# EAGLE design LED_Matrix_3_5_tiny (EAGLE 8.2.2)
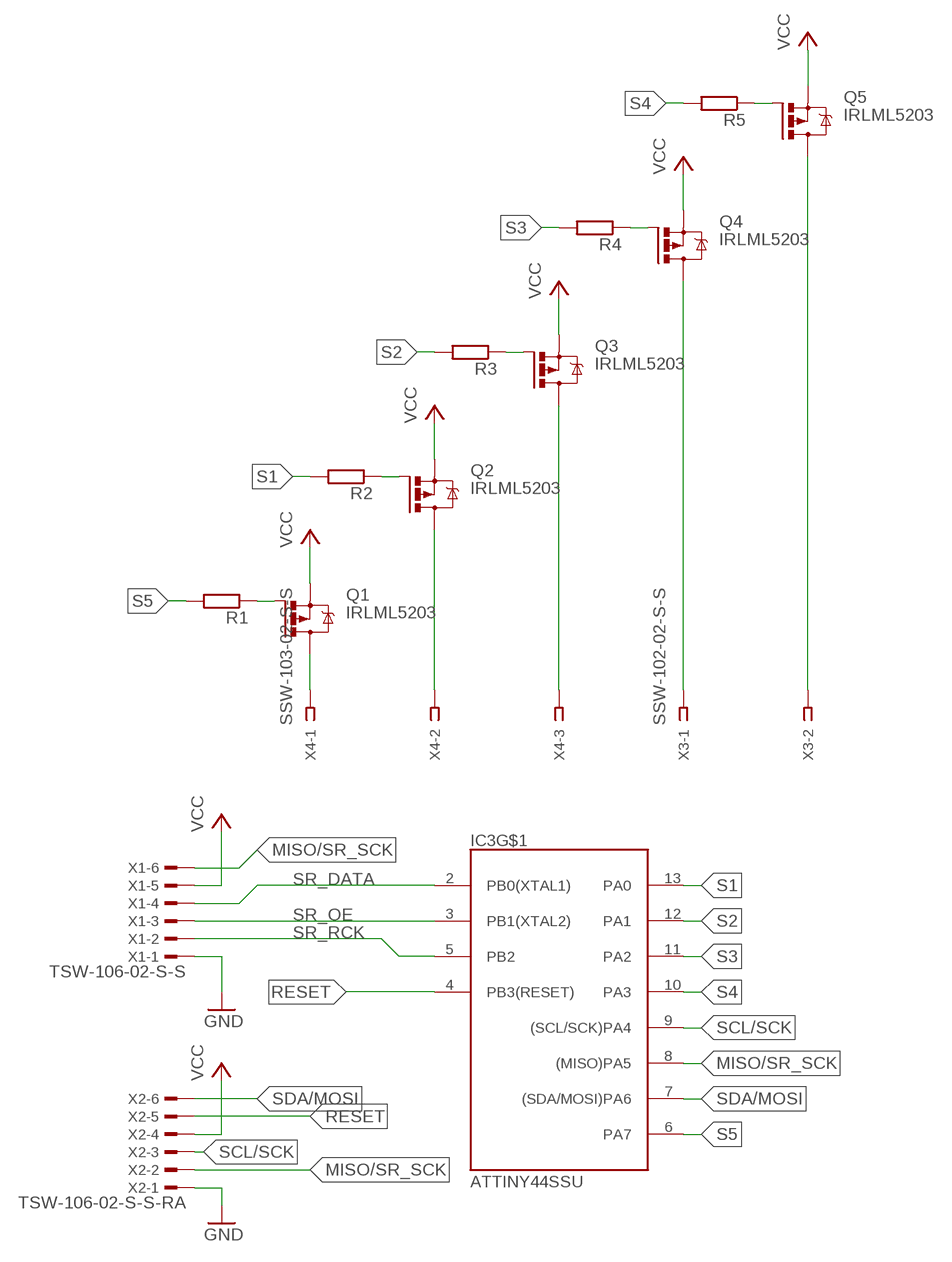
[diagram p0: schematic, sheet 1]

## Parts
IC3  ATTINY44SSU  [SO14]
Q1  IRLML5203  [MICRO3]
Q2  IRLML5203  [MICRO3]
Q3  IRLML5203  [MICRO3]
Q4  IRLML5203  [MICRO3]
Q5  IRLML5203  [MICRO3]
R1  R-EU_R0603  [R0603]
R2  R-EU_R0603  [R0603]
R3  R-EU_R0603  [R0603]
R4  R-EU_R0603  [R0603]
R5  R-EU_R0603  [R0603]
X1  TSW-106-02-S-S  [TSW-106-02-S-S]
X2  TSW-106-02-S-S-RA  [TSW-106-02-S-S-RA]
X3  SSW-102-02-S-S  [SSW-102-02-S-S]
X4  SSW-103-02-S-S  [SSW-103-02-S-S]

## Nets
GND: X1.1 X2.1
MISO/SR_SCK: IC3.8((MISO)PA5) X1.6 X2.2
N$9: Q2.1(G) R2.1
N$15: Q3.1(G) R3.1
N$16: Q4.1(G) R4.1
N$17: Q5.1(G) R5.1
N$18: Q1.1(G) R1.1
N$19: Q5.3(D) X3.2
N$20: Q4.3(D) X3.1
N$21: Q3.3(D) X4.3
N$22: Q2.3(D) X4.2
N$23: Q1.3(D) X4.1
RESET: IC3.4(PB3(RESET)) X2.5
S1: IC3.13(PA0) R2.2
S2: IC3.12(PA1) R3.2
S3: IC3.11(PA2) R4.2
S4: IC3.10(PA3) R5.2
S5: IC3.6(PA7) R1.2
SCL/SCK: IC3.9((SCL/SCK)PA4) X2.3
SDA/MOSI: IC3.7((SDA/MOSI)PA6) X2.6
SR_DATA: IC3.2(PB0(XTAL1)) X1.4
SR_OE: IC3.3(PB1(XTAL2)) X1.3
SR_RCK: IC3.5(PB2) X1.2
VCC: Q1.2(S) Q2.2(S) Q3.2(S) Q4.2(S) Q5.2(S) X1.5 X2.4

## Power pins joined to a net without a drawn wire
GND: IC3.14(GND)
VCC: IC3.1(VCC)

## Library data of the parts
IC3 = Attiny:ATTINY44: ATtiny24A/44A/84A are low-power CMOS 8-bit microcontrollers based on the AVR enhanced RISC architecture. By executing powerful in structions in a single clock cycle, the ATtiny24A/44A/84A achieves throughputs approaching 1 MIPS per MHz allowing the system designer to optimize power consum ption versus processing speed.
Q1-Q5 = transistor-power:IRLML5203: HEXFET P-Channel Power MOSFET
R1-R5 = resistor:R-EU_: RESISTOR, European symbol
X1 X2 = con-samtec:TSW-106-02-S-S: THROUGH-HOLE .025" SQ POST HEADER Source: Samtec TSW.pdf; OC_FARNELL: unknown; OC_NEWARK: unknown
X3 = con-samtec:SSW-102-02-S-S: THROUGH-HOLE .025" SQ POST SOCKET Source: Samtec SSW.pdf; MPN: SSW-102-02-S-S; OC_FARNELL: unknown; OC_NEWARK: 11P9351
X4 = con-samtec:SSW-103-02-S-S: THROUGH-HOLE .025" SQ POST SOCKET Source: Samtec SSW.pdf; MPN: SSW-103-02-S-S; OC_FARNELL: unknown; OC_NEWARK: 11P9367

## Board
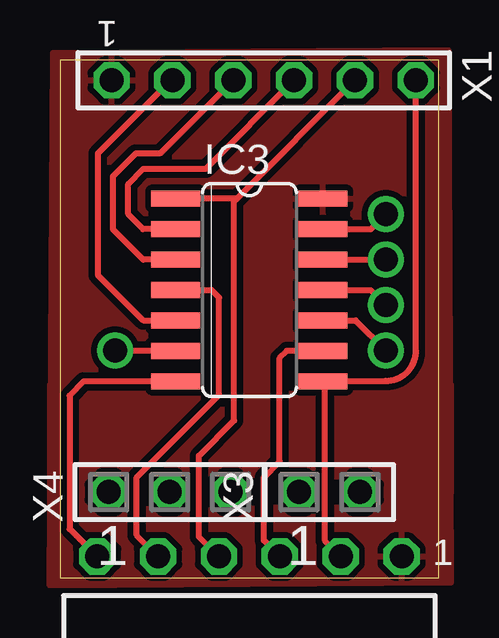
[diagram p1: board, top side]
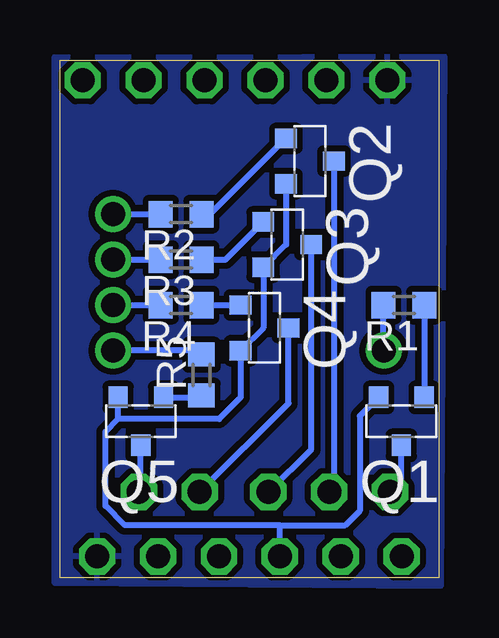
[diagram p2: board, bottom side, seen from below]

Size 15.8 x 21.6 mm. Coordinates in mm from the lower left corner, seen from the top.
Outline: 0,0 15.8,0 15.8,21.6 0,21.6 0,0
Copper layers (1*16): Top 0.035mm / dielectric 1.5mm / Bottom 0.035mm
Design rules "default *": minimum track width 10mil, minimum drill 24mil, track to track 10mil, track to pad 10mil, pad to pad 10mil, via to via 10mil, smd to smd 8mil, copper to edge 0mil, drill to drill 8mil, minimum pad ring 10mil, minimum via ring 8mil, stop-mask expansion 4mil, vias tented up to drill 0mil, thermal gap 10mil

### Footprints (pad centres in the part's own frame; a part is rotated, then mirrored left to right if it is on the bottom)
SO14 = smd 0.66 x 2.032: 1 -3.81,-3.073; 2 -2.54,-3.073; 3 -1.27,-3.073; 4 0,-3.073; 5 1.27,-3.073; 6 2.54,-3.073; 7 3.81,-3.073; 8 3.81,3.073; 9 2.54,3.073; 10 1.27,3.073; 11 0,3.073; 12 -1.27,3.073; 13 -2.54,3.073; 14 -3.81,3.073
MICRO3 = smd 0.8 x 0.9: 1 -0.95,-1; 2 0.95,-1; 3 0,1
R0603 = smd 1 x 1.1: 1 -0.85,0; 2 0.85,0
TSW-106-02-S-S = drill 1 pad 1.5 octagon: 1 6.35,0; 2 3.81,0; 3 1.27,0; 4 -1.27,0; 5 -3.81,0; 6 -6.35,0
TSW-106-02-S-S-RA = drill 1 pad 1.5 octagon: 1 6.35,1.524; 2 3.81,1.524; 3 1.27,1.524; 4 -1.27,1.524; 5 -3.81,1.524; 6 -6.35,1.524
SSW-102-02-S-S = drill 1 pad 1.5 octagon: 1 -1.27,0; 2 1.27,0
SSW-103-02-S-S = drill 1 pad 1.5 octagon: 1 -2.54,0; 2 0,0; 3 2.54,0

### Placement (x,y rotation side)
IC3  7.9,12.01 270 top
Q1  1.56,6.53 180 bottom
Q2  5.37,17.38 270 bottom
Q3  6.32,13.9 270 bottom
Q4  7.27,10.43 270 bottom
Q5  12.43,6.53 180 bottom
R1  1.46,11.38 180 bottom
R2  10.74,15.17 180 bottom
R3  10.74,13.27 180 bottom
R4  10.74,11.38 180 bottom
R5  9.9,8.46 90 bottom
X1  8.5,20.75 180 top
X2  7.9,-0.63 0 top
X3  11.24,3.58 0 top
X4  4.57,3.58 0 top

### Tracks (layer width: path | path; a pad name or v marks a point on that pad's centre or on a via)
GND
  pour Bottom (isolate 0.254): -0.22,21.76 -0.08,-0.34 16.01,-0.22 16.01,21.74 11.59,21.71
  pour Top (isolate 0.254): -0.29,21.89 16.19,22.02 16.31,-0.2 -0.42,-0.33 -0.32,15.84
MISO/SR_SCK
  Top 0.254: X1.6 14.85,9.48 arc-90 13.59,8.22 10.99,8.22 IC3.8 11.06,8.11 11.06,1.54 X2.2 11.71,0.93
N$1
  pour Top: -0.4,8.1 16.3,8.1 16.3,3.5 -0.4,3.5
N$9
  Bottom 0.254: 9.53,15.17 R2.1 9.53,15.17 | 9.53,15.17 Q2.1
N$15
  Bottom 0.254: R3.1 8.9,13.27 Q3.1
N$16
  Bottom 0.254: R4.1 Q4.1
N$17
  Bottom 0.254: Q5.1 9.8,7.53 R5.1
N$18
  Bottom 0.254: R1.1 Q1.1
N$19
  Bottom 0.254: X3.2 12.43,3.66 Q5.3
N$20
  Bottom 0.254: Q4.3 6.27,7.28 X3.1
N$21
  Bottom 0.254: Q3.3 5.32,5.37 X4.3
N$22
  Bottom 0.254: 4.34,17.35 Q2.3 | 4.34,17.35 4.28,17.29 | 4.34,17.35 4.34,3.81 X4.2
N$23
  Bottom 0.254: Q1.3 1.56,4.05 X4.1
RESET
  Top 0.254: IC3.4 6.32,12.01 6.64,11.69 6.64,7.64 3.2,4.2 3.2,1.78 X2.5 4.09,0.91
S1  (via drill 1)
  Top 0.254: IC3.13 12.97,14.55 v13.59,15.17
  Bottom 0.254: v13.59,15.17 R2.2
S2  (via drill 1)
  Top 0.254: IC3.12 v13.58,13.28 v13.59,13.27
  Bottom 0.254: v13.59,13.27 R3.2
S3  (via drill 1)
  Top 0.254: IC3.11 12.96,12.01 v13.59,11.38
  Bottom 0.254: v13.59,11.38 R4.2
S4  (via drill 1)
  Top 0.254: IC3.10 12.33,10.74 v13.59,9.48
  Bottom 0.254: R5.2 10.06,9.48 v13.59,9.48
S5  (via drill 1)
  Top 0.254: 4.81,9.48 arc-90 IC3.6 v2.3,9.48
  Bottom 0.254: v2.3,9.48 v2.31,9.48 R1.2
SCL/SCK
  Top 0.254: 9.17,0.94 X2.3 8.5,1.56 8.5,4.2 9.16,4.86 9.16,9.16 9.47,9.47 IC3.9 10.96,9.48
SDA/MOSI
  Top 0.254: IC3.7 1,8.2 0.4,7.6 0.4,2.04 X2.6
SR_DATA
  Top 0.254: IC3.2 3.47,14.55 2.84,15.17 2.84,16.43 3.48,17.06 6.08,17.06 X1.4
SR_OE
  Top 0.254: X1.3 4.18,17.7 3.16,17.7 2.21,16.75 2.21,14.54 3.47,13.28 IC3.3
SR_RCK
  Top 0.254: X1.2 4.63,20.75 1.58,17.7 1.58,12.64 3.48,10.74 IC3.5
VCC
  Top 0.254: 7.38,15.82 X1.5 | 7.38,15.82 IC3.1 | 6.63,0.95 X2.4 5.8,1.72 5.8,5.1 7.27,6.57 7.27,15.71 7.38,15.82
  Bottom 0.254: Q2.2 6.37,13.9 Q3.2 7.32,10.43 Q4.2 8.27,7.53 9.16,6.64 9.16,6.62 13.38,6.62 | 2.71,7.34 Q1.2 3.3,6.75 3.3,2.8 3.9,2.2 6.63,2.2 | 6.63,2.2 13.1,2.2 13.9,3 13.9,6.1 13.38,6.62 | 13.38,6.62 Q5.2 | X2.4 6.63,2.2

### Text on the board
Document: Zusatzanzeiger / -> Steuerungsplatine